# EAGLE schematic USBHubAndSensors (EAGLE 6.0)
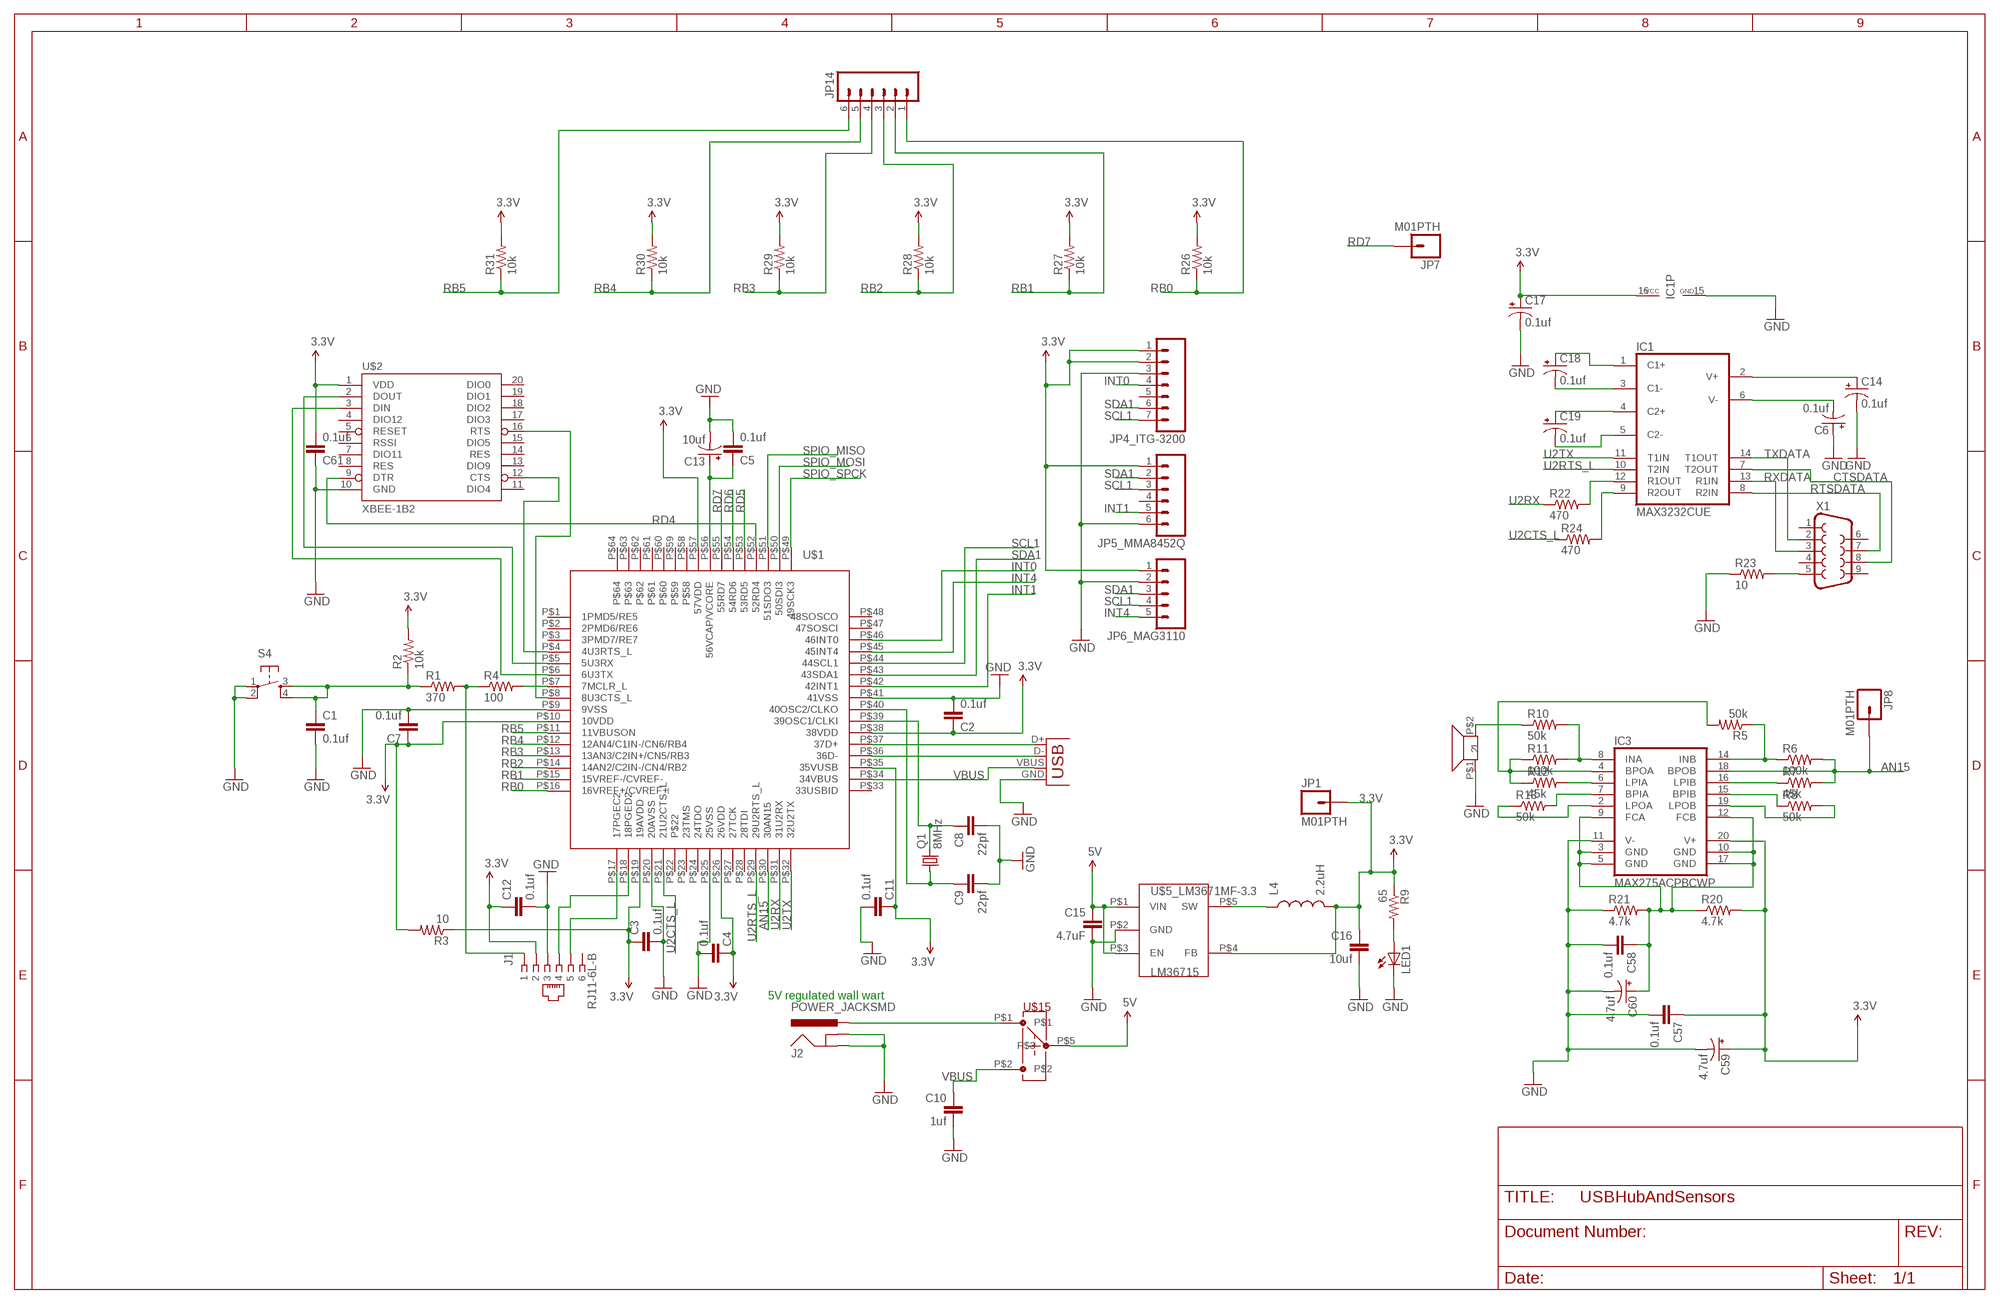
[diagram p0: schematic, sheet 1, part 1 of 2]
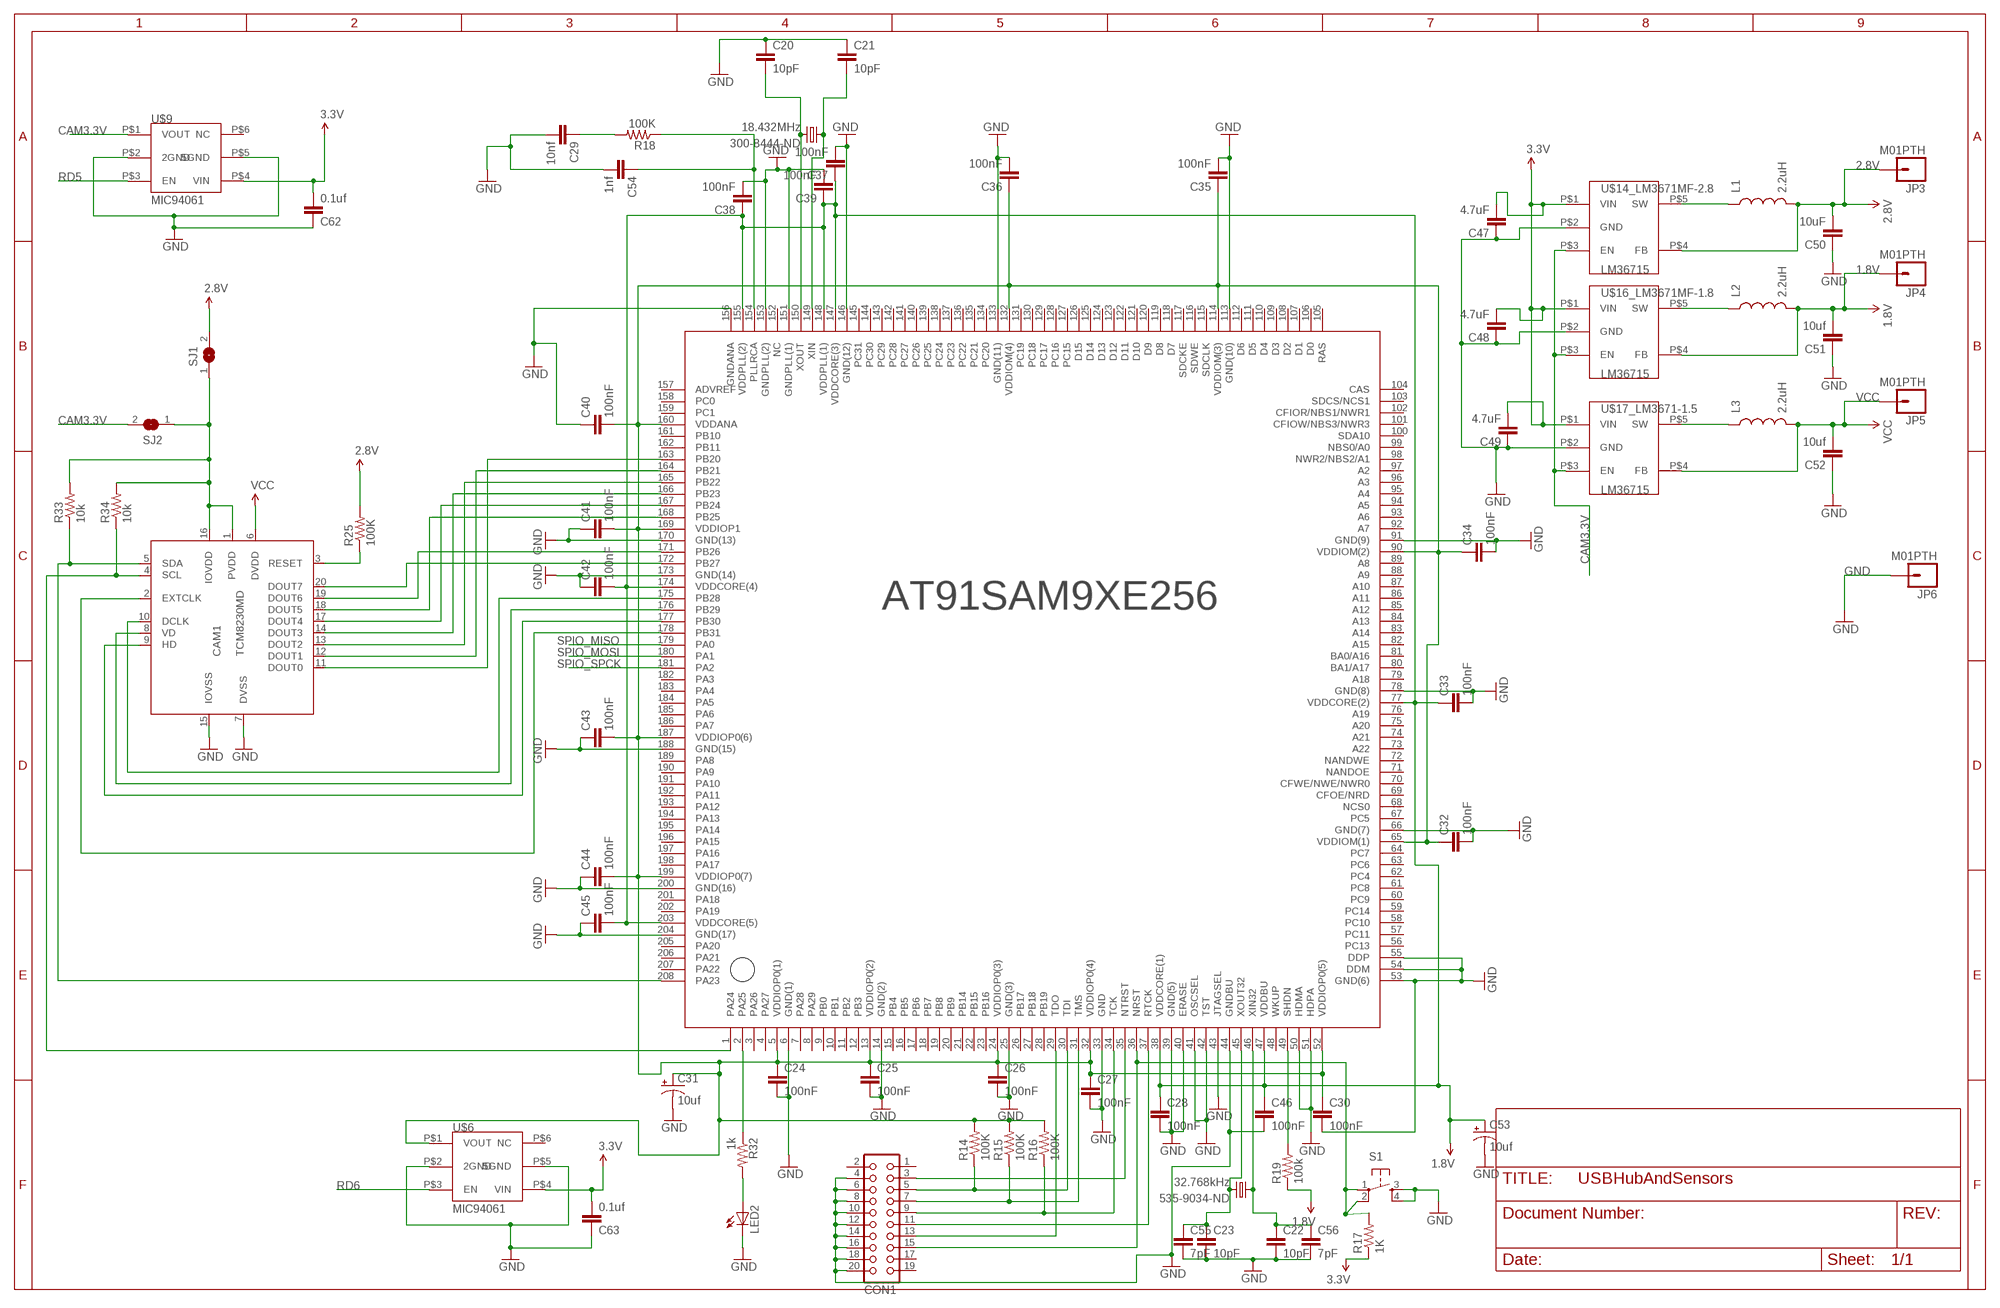
[diagram p1: schematic, sheet 1, part 2 of 2]

## Parts
300-8444-ND  18.432MHz  CRYSTALTC38H  [TC38H]
535-9034-ND  32.768kHz  CRYSTALTC38H  [TC38H]
C1  0.1uf  CAP1206  [1206]
C2  0.1uf  CAP1206  [1206]
C3  0.1uf  CAP1206  [1206]
C4  0.1uf  CAP1206  [1206]
C5  0.1uf  CAP1206  [1206]
C6  0.1uf  CAP_POL1206  [EIA3216]
C7  0.1uf  CAP1206  [1206]
C8  22pf  CAP1206  [1206]
C9  22pf  CAP1206  [1206]
C10  1uf  CAP1206  [1206]
C11  0.1uf  CAP1206  [1206]
C12  0.1uf  CAP1206  [1206]
C13  10uf  CAP_POL1206  [EIA3216]
C14  0.1uf  CAP_POL1206  [EIA3216]
C15  4.7uF  CAP1206  [1206]
C16  10uf  CAP1206  [1206]
C17  0.1uf  CAP_POL1206  [EIA3216]
C18  0.1uf  CAP_POL1206  [EIA3216]
C19  0.1uf  CAP_POL1206  [EIA3216]
C20  10pF  CAP1206  [1206]
C21  10pF  CAP1206  [1206]
C22  10pF  CAP1206  [1206]
C23  10pF  CAP1206  [1206]
C24  100nF  CAP1206  [1206]
C25  100nF  CAP1206  [1206]
C26  100nF  CAP1206  [1206]
C27  100nF  CAP1206  [1206]
C28  100nF  CAP1206  [1206]
C29  10nf  CAP1206  [1206]
C30  100nF  CAP1206  [1206]
C31  10uf  CAP_POL1206  [EIA3216]
C32  100nF  CAP1206  [1206]
C33  100nF  CAP1206  [1206]
C34  100nF  CAP1206  [1206]
C35  100nF  CAP1206  [1206]
C36  100nF  CAP1206  [1206]
C37  100nF  CAP1206  [1206]
C38  100nF  CAP1206  [1206]
C39  100nF  CAP1206  [1206]
C40  100nF  CAP1206  [1206]
C41  100nF  CAP1206  [1206]
C42  100nF  CAP1206  [1206]
C43  100nF  CAP1206  [1206]
C44  100nF  CAP1206  [1206]
C45  100nF  CAP1206  [1206]
C46  100nF  CAP1206  [1206]
C47  4.7uF  CAP1206  [1206]
C48  4.7uF  CAP1206  [1206]
C49  4.7uF  CAP1206  [1206]
C50  10uF  CAP1206  [1206]
C51  10uf  CAP1206  [1206]
C52  10uf  CAP1206  [1206]
C53  10uf  CAP_POL1206  [EIA3216]
C54  1nf  CAP1206  [1206]
C55  7pF  CAP1206  [1206]
C56  7pF  CAP1206  [1206]
C57  0.1uf  CAP1206  [1206]
C58  0.1uf  CAP1206  [1206]
C59  4.7uf  CAP_POL1206  [EIA3216]
C60  4.7uf  CAP_POL1206  [EIA3216]
C61  0.1uf  CAP1206  [1206]
C62  0.1uf  CAP1206  [1206]
C63  0.1uf  CAP1206  [1206]
CAM1  TCM8230MD  [TCM8230MD]
CON1  CON20  [CON20]
IC1  MAX3232CUE  [TSSOP16]
IC3  MAX275ACPBCWP  [SO20L]
J1  RJ11-6L-B  [RJ11-NO_SHIELD]
J2  POWER_JACKSMD  [POWER_JACK_SMD]
JP1  M01PTH  [1X01]
JP3  M01PTH  [1X01]
JP4  M01PTH  [1X01]
JP4_ITG-3200  M07  [1X07]
JP5  M01PTH  [1X01]
JP5_MMA8452Q  M06SIP  [1X06]
JP6  M01PTH  [1X01]
JP6_MAG3110  M05PTH  [1X05]
JP7  M01PTH  [1X01]
JP8  M01PTH  [1X01]
JP14  M06SIP  [1X06]
L1  2.2uH  INDUCTOR1210  [1210]
L2  2.2uH  INDUCTOR1210  [1210]
L3  2.2uH  INDUCTOR1210  [1210]
L4  2.2uH  INDUCTOR1210  [1210]
LED1  LED-FKIT-1206  [FKIT-LED-1206]
LED2  LED-FKIT-1206  [FKIT-LED-1206]
Q1  8MHz  CRYSTALHC49UP  [HC49UP]
R1  370  RESISTOR1206  [1206]
R2  10k  RESISTOR1206  [1206]
R3  10  RESISTOR1206  [1206]
R4  100  RESISTOR1206  [1206]
R5  50k  RESISTOR1206  [1206]
R6  100k  RESISTOR1206  [1206]
R7  45k  RESISTOR1206  [1206]
R8  50k  RESISTOR1206  [1206]
R9  65  RESISTOR1206  [1206]
R10  50k  RESISTOR1206  [1206]
R11  100k  RESISTOR1206  [1206]
R12  45k  RESISTOR1206  [1206]
R13  50k  RESISTOR1206  [1206]
R14  100K  RESISTOR1206  [1206]
R15  100K  RESISTOR1206  [1206]
R16  100K  RESISTOR1206  [1206]
R17  1K  RESISTOR1206  [1206]
R18  100K  RESISTOR1206  [1206]
R19  100k  RESISTOR1206  [1206]
R20  4.7k  RESISTOR1206  [1206]
R21  4.7k  RESISTOR1206  [1206]
R22  470  RESISTOR1206  [1206]
R23  10  RESISTOR1206  [1206]
R24  470  RESISTOR1206  [1206]
R25  100K  RESISTOR1206  [1206]
R26  10k  RESISTOR1206  [1206]
R27  10k  RESISTOR1206  [1206]
R28  10k  RESISTOR1206  [1206]
R29  10k  RESISTOR1206  [1206]
R30  10k  RESISTOR1206  [1206]
R31  10k  RESISTOR1206  [1206]
R32  1k  RESISTOR1206  [1206]
R33  10k  RESISTOR1206  [1206]
R34  10k  RESISTOR1206  [1206]
S1  TAC_SWITCHPTH  [TACTILE-PTH]
S4  TAC_SWITCHPTH  [TACTILE-PTH]
SJ1  SJ  [SJ]
SJ2  SJ  [SJ]
U$1  PIC32MX534F06HTQFP  [64-TQFP]
U$2  XBEE-1B2  [XBEE-SILK]
U$5  40TR-12B  [40TR]
U$5_LM3671MF-3.3  LM36715  [SOT23-5]
U$6  MIC94061YC6  [SC-70-6]
U$7  AT91SAM9XE256  [PQFP208]
U$9  MIC94061YC6  [SC-70-6]
U$14_LM3671MF-2.8  LM36715  [SOT23-5]
U$15  G-107PLUG-IN  [G-197]
U$16_LM3671MF-1.8  LM36715  [SOT23-5]
U$17_LM3671-1.5  LM36715  [SOT23-5]
X1  DB9FEMALE  [DB9]
X2  USB-MICROB  [USB-MICROB]

## Nets
1.8V: C28.1 C33.1 C37.1 C38.1 C39.1 C42.2 C45.2 C46.1 C51.2 C53.A(+) JP4.1 L2.2 R19.1 U$7.38(VDDCORE(1)) U$7.47(VDDBU) U$7.77(VDDCORE(2)) U$7.147(VDDCORE(3)) U$7.148(VDDPLL(1)) U$7.155(VDDPLL(2)) U$7.174(VDDCORE(4)) U$7.203(VDDCORE(5)) U$16_LM3671MF-1.8.P$4(FB)
2.8V: C50.2 JP3.1 L1.2 R25.2 SJ1.2 U$14_LM3671MF-2.8.P$4(FB)
3.3V: C2.1 C3.1 C4.1 C7.1 C11.1 C12.1 C16.1 C17.A(+) C47.2 C48.2 C49.2 C57.1 C59.A(+) C61.2 C62.2 C63.2 IC1.16(VCC) IC3.20(V+) J1.2 JP1.1 JP4_ITG-3200.1 JP4_ITG-3200.2 JP5_MMA8452Q.1 JP6_MAG3110.1 L4.2 R2.2 R3.1 R3.2 R9.1 R17.1 R20.2 R26.2 R27.2 R28.2 R29.2 R30.2 R31.2 U$1.P$10(10VDD) U$1.P$19(19AVDD) U$1.P$26(26VDD) U$1.P$35(35VUSB) U$1.P$38(38VDD) U$1.P$57(57VDD) U$2.1(VDD) U$5_LM3671MF-3.3.P$4(FB) U$6.P$4(VIN) U$9.P$4(VIN) U$14_LM3671MF-2.8.P$1(VIN) U$16_LM3671MF-1.8.P$1(VIN) U$17_LM3671-1.5.P$1(VIN)
5V: C15.1 U$5_LM3671MF-3.3.P$1(VIN) U$5_LM3671MF-3.3.P$3(EN) U$15.P$5
AN15: IC3.18(BPOB) JP8.1 R6.2 R7.2 U$1.P$30(30AN15)
CAM3.3V: SJ2.2 U$9.P$1(VOUT) U$14_LM3671MF-2.8.P$3(EN) U$16_LM3671MF-1.8.P$3(EN) U$17_LM3671-1.5.P$3(EN)
CTSDATA: IC1.7(T2OUT) X1.8
GND: C1.2 C2.2 C3.2 C4.2 C5.2 C6.A(+) C7.2 C8.2 C9.2 C10.2 C11.2 C12.2 C13.C(-) C14.C(-) C15.2 C16.2 C17.C(-) C20.1 C21.1 C22.2 C23.2 C24.2 C25.2 C26.2 C27.2 C28.2 C29.2 C30.2 C31.C(-) C32.2 C33.2 C34.2 C35.2 C36.2 C37.2 C38.2 C39.2 C40.1 C41.1 C42.1 C43.1 C44.1 C45.1 C46.2 C47.1 C48.1 C49.1 C50.1 C51.1 C52.1 C53.C(-) C54.2 C55.2 C56.2 C57.2 C58.2 C59.C(-) C60.C(-) C61.1 C62.1 C63.1 CAM1.7(DVSS) CAM1.15(IOVSS) CON1.4 CON1.6 CON1.8 CON1.10 CON1.12 CON1.14 CON1.16 CON1.18 CON1.20 IC1.15(GND) IC3.11(V-) J1.3 J2.GND(GNDBREAK) J2.P$4(GND) JP4_ITG-3200.3 JP5_MMA8452Q.6 JP6.1 JP6_MAG3110.2 LED1.C LED2.C R21.1 R23.1 S1.3 S1.4 S4.1 S4.2 U$1.P$9(9VSS) U$1.P$20(20AVSS) U$1.P$25(25VSS) U$1.P$41(41VSS) U$2.10(GND) U$5.P$1 U$5_LM3671MF-3.3.P$2(GND) U$6.P$2(2GND) U$6.P$5(5GND) U$7.6(GND(1)) U$7.14(GND(2)) U$7.25(GND(3)) U$7.33(GND) U$7.39(GND(5)) U$7.40(ERASE) U$7.41(OSCSEL) U$7.42(TST) U$7.43(JTAGSEL) U$7.44(GNDBU) U$7.50(HDMA) U$7.51(HDPA) U$7.53(GND(6)) U$7.54(DDM) U$7.55(DDP) U$7.66(GND(7)) U$7.78(GND(8)) U$7.91(GND(9)) U$7.113(GND(10)) U$7.133(GND(11)) U$7.146(GND(12)) U$7.151(GNDPLL(1)) U$7.153(GNDPLL(2)) U$7.156(GNDANA) U$7.170(GND(13)) U$7.173(GND(14)) U$7.188(GND(15)) U$7.200(GND(16)) U$7.204(GND(17)) U$9.P$2(2GND) U$9.P$5(5GND) U$14_LM3671MF-2.8.P$2(GND) U$16_LM3671MF-1.8.P$2(GND) U$17_LM3671-1.5.P$2(GND) X2.GND
INT0: JP4_ITG-3200.4 U$1.P$46(46INT0)
INT1: JP5_MMA8452Q.5 U$1.P$42(42INT1)
INT4: JP6_MAG3110.5 U$1.P$45(45INT4)
N$1: C1.1 R1.1 R2.1 S4.3 S4.4
N$2: C24.1 C25.1 C26.1 C27.1 C30.1 C31.A(+) C32.1 C34.1 C35.1 C36.1 C40.2 C41.2 C43.2 C44.2 R14.2 R15.2 R16.2 U$6.P$1(VOUT) U$7.5(VDDIOP0(1)) U$7.13(VDDIOP0(2)) U$7.24(VDDIOP0(3)) U$7.32(VDDIOP0(4)) U$7.52(VDDIOP0(5)) U$7.65(VDDIOM(1)) U$7.90(VDDIOM(2)) U$7.114(VDDIOM(3)) U$7.132(VDDIOM(4)) U$7.160(VDDANA) U$7.169(VDDIOP1) U$7.187(VDDIOP0(6)) U$7.199(VDDIOP0(7))
N$3: J1.4 U$1.P$18(18PGED2)
N$4: C9.1 Q1.1 U$1.P$40(40OSC2/CLKO)
N$5: C8.1 Q1.2 U$1.P$39(39OSC1/CLKI)
N$6: R4.2 U$1.P$7(7MCLR_L)
N$7: J1.5 U$1.P$17(17PGEC2)
N$8: L4.1 U$5_LM3671MF-3.3.P$5(SW)
N$9: U$1.P$6(6U3TX) U$2.3(DIN)
N$10: C18.A(+) IC1.1(C1+)
N$11: C18.C(-) IC1.3(C1-)
N$12: C19.A(+) IC1.4(C2+)
N$13: C5.1 C13.A(+) U$1.P$56(56VCAP/VCORE)
N$14: U$1.P$36(36D-) X2.D-
N$15: U$1.P$37(37D+) X2.D+
N$16: C19.C(-) IC1.5(C2-)
N$17: U$1.P$5(5U3RX) U$2.2(DOUT)
N$18: U$1.P$8(8U3CTS_L) U$2.16(RTS)
N$19: U$1.P$4(4U3RTS_L) U$2.12(CTS)
N$20: CON1.11 U$7.37(RTCK)
N$21: J1.1 R1.2 R4.1
N$22: CAM1.3(RESET) R25.1
N$23: C14.A(+) IC1.2(V+)
N$24: C6.C(-) IC1.6(V-)
N$25: IC3.14(INB) R5.1 R6.1
N$26: R10.1 U$5.P$2
N$27: IC3.16(LPIB) R7.1
N$28: LED1.A R9.2
N$29: IC3.15(BPIB) R8.1
N$30: IC3.19(LPOB) R8.2
N$31: IC3.2(LPOA) R13.1
N$32: IC3.7(BPIA) R13.2
N$33: IC3.6(LPIA) R12.2
N$34: IC3.8(INA) R10.2 R11.2
N$35: IC3.4(BPOA) R5.2 R11.1 R12.1
N$36: CAM1.11(DOUT0) U$7.163(PB20)
N$37: CAM1.12(DOUT1) U$7.164(PB21)
N$38: CAM1.13(DOUT2) U$7.165(PB22)
N$39: CAM1.14(DOUT3) U$7.166(PB23)
N$40: CAM1.17(DOUT4) U$7.167(PB24)
N$41: CAM1.18(DOUT5) U$7.168(PB25)
N$42: CAM1.19(DOUT6) U$7.171(PB26)
N$43: CAM1.20(DOUT7) U$7.172(PB27)
N$44: CAM1.10(DCLK) U$7.175(PB28)
N$45: CAM1.8(VD) U$7.176(PB29)
N$46: CAM1.9(HD) U$7.177(PB30)
N$47: CAM1.2(EXTCLK) U$7.178(PB31)
N$48: CAM1.4(SCL) R34.1 U$7.1(PA24)
N$49: CAM1.5(SDA) R33.1 U$7.208(PA23)
N$50: 300-8444-ND.1 C21.2 U$7.149(XIN)
N$51: 300-8444-ND.2 C20.2 U$7.150(XOUT)
N$52: 535-9034-ND.1 C22.1 C56.1 U$7.46(XIN32)
N$53: 535-9034-ND.2 C23.1 C55.1 U$7.45(XOUT32)
N$54: CON1.5 R14.1 U$7.30(TDI)
N$55: CON1.7 R15.1 U$7.31(TMS)
N$56: CON1.9 R16.1 U$7.34(TCK)
N$57: CON1.13 U$7.29(TDO)
N$58: CON1.3 U$7.35(NTRST)
N$59: CAM1.1(PVDD) CAM1.16(IOVDD) R33.2 R34.2 SJ1.1 SJ2.1
N$60: L1.1 U$14_LM3671MF-2.8.P$5(SW)
N$61: L2.1 U$16_LM3671MF-1.8.P$5(SW)
N$62: L3.1 U$17_LM3671-1.5.P$5(SW)
N$63: C54.1 R18.1 U$7.154(PLLRCA)
N$64: C29.1 R18.2
N$65: R19.2 U$7.49(SHDN)
N$66: J2.VIN0(PWR) U$15.P$1
N$67: IC1.12(R1OUT) R22.2
N$68: C58.1 C60.A(+) IC3.3(GND) IC3.5(GND) IC3.9(FCA) IC3.10(GND) IC3.12(FCB) IC3.17(GND) R20.1 R21.2
N$69: R23.2 X1.5
N$70: R32.1 U$7.2(PA25)
N$71: IC1.9(R2OUT) R24.2
N$72: LED2.A R32.2
N$80: CON1.15 R17.2 S1.1 S1.2 U$7.36(NRST)
RB0: JP14.1 R26.1 U$1.P$16(16VREF+/CVREF+)
RB1: JP14.2 R27.1 U$1.P$15(15VREF-/CVREF-)
RB2: JP14.3 R28.1 U$1.P$14(14AN2/C2IN-/CN4/RB2)
RB3: JP14.4 R29.1 U$1.P$13(13AN3/C2IN+/CN5/RB3)
RB4: JP14.5 R30.1 U$1.P$12(12AN4/C1IN-/CN6/RB4)
RB5: JP14.6 R31.1 U$1.P$11(11VBUSON)
RD4: U$1.P$52(52RD4) U$2.9(DTR)
RD5: U$1.P$53(53RD5) U$9.P$3(EN)
RD6: U$1.P$54(54RD6) U$6.P$3(EN)
RD7: JP7.1 U$1.P$55(55RD7)
RTSDATA: IC1.8(R2IN) X1.7
RXDATA: IC1.13(R1IN) X1.3
SCL1: JP4_ITG-3200.7 JP5_MMA8452Q.3 JP6_MAG3110.4 U$1.P$44(44SCL1)
SDA1: JP4_ITG-3200.6 JP5_MMA8452Q.2 JP6_MAG3110.3 U$1.P$43(43SDA1)
SPIO_MISO: U$1.P$51(51SDO3) U$7.179(PA0)
SPIO_MOSI: U$1.P$50(50SDI3) U$7.180(PA1)
SPIO_SPCK: U$1.P$49(49SCK3) U$7.181(PA2)
TXDATA: IC1.14(T1OUT) X1.2
U2CTS_L: R24.1 U$1.P$21(21U2CTS_L)
U2RTS_L: IC1.10(T2IN) U$1.P$29(29U2RTS_L)
U2RX: R22.1 U$1.P$31(31U2RX)
U2TX: IC1.11(T1IN) U$1.P$32(32U2TX)
VBUS: C10.1 U$1.P$34(34VBUS) U$15.P$2 X2.VBUS
VCC: C52.2 CAM1.6(DVDD) JP5.1 L3.2 U$17_LM3671-1.5.P$4(FB)
Unconnected: CON1.1 CON1.2 CON1.17 CON1.19 J1.6 JP4_ITG-3200.5 JP5_MMA8452Q.4 U$1.P$1(1PMD5/RE5) U$1.P$2(2PMD6/RE6) U$1.P$3(3PMD7/RE7) U$1.P$22 U$1.P$23(23TMS) U$1.P$24(24TDO) U$1.P$27(27TCK) U$1.P$28(28TDI) U$1.P$33(33USBID) U$1.P$47(47SOSCI) U$1.P$48(48SOSCO) U$1.P$58 U$1.P$59 U$1.P$60 U$1.P$61 U$1.P$62 U$1.P$63 U$1.P$64 U$2.4(DIO12) U$2.5(RESET) U$2.6(RSSI) U$2.7(DIO11) U$2.8(RES) U$2.11(DIO4) U$2.13(DIO9) U$2.14(RES) U$2.15(DIO5) U$2.17(DIO3) U$2.18(DIO2) U$2.19(DIO1) U$2.20(DIO0) U$6.P$6(NC) U$7.3(PA26) U$7.4(PA27) U$7.7(PA28) U$7.8(PA29) U$7.9(PB0) U$7.10(PB1) U$7.11(PB2) U$7.12(PB3) U$7.15(PB4) U$7.16(PB5) U$7.17(PB6) U$7.18(PB7) U$7.19(PB8) U$7.20(PB9) U$7.21(PB14) U$7.22(PB15) U$7.23(PB16) U$7.26(PB17) U$7.27(PB18) U$7.28(PB19) U$7.48(WKUP) U$7.56(PC13) U$7.57(PC11) U$7.58(PC10) U$7.59(PC14) U$7.60(PC9) U$7.61(PC8) U$7.62(PC4) U$7.63(PC6) U$7.64(PC7) U$7.67(PC5) U$7.68(NCS0) U$7.69(CFOE/NRD) U$7.70(CFWE/NWE/NWR0) U$7.71(NANDOE) U$7.72(NANDWE) U$7.73(A22) U$7.74(A21) U$7.75(A20) U$7.76(A19) U$7.79(A18) U$7.80(BA1/A17) U$7.81(BA0/A16) U$7.82(A15) U$7.83(A14) U$7.84(A13) U$7.85(A12) U$7.86(A11) U$7.87(A10) U$7.88(A9) U$7.89(A8) U$7.92(A7) U$7.93(A6) U$7.94(A5) U$7.95(A4) U$7.96(A3) U$7.97(A2) U$7.98(NWR2/NBS2/A1) U$7.99(NBS0/A0) U$7.100(SDA10) U$7.101(CFIOW/NBS3/NWR3) U$7.102(CFIOR/NBS1/NWR1) U$7.103(SDCS/NCS1) U$7.104(CAS) U$7.105(RAS) U$7.106(D0) U$7.107(D1) U$7.108(D2) U$7.109(D3) U$7.110(D4) U$7.111(D5) U$7.112(D6) U$7.115(SDCLK) U$7.116(SDWE) U$7.117(SDCKE) U$7.118(D7) U$7.119(D8) U$7.120(D9) U$7.121(D10) U$7.122(D11) U$7.123(D12) U$7.124(D13) U$7.125(D14) U$7.126(D15) U$7.127(PC15) U$7.128(PC16) U$7.129(PC17) U$7.130(PC18) U$7.131(PC19) U$7.134(PC20) U$7.135(PC21) U$7.136(PC22) U$7.137(PC23) U$7.138(PC24) U$7.139(PC25) U$7.140(PC26) U$7.141(PC27) U$7.142(PC28) U$7.143(PC29) U$7.144(PC30) U$7.145(PC31) U$7.152(NC) U$7.157(ADVREF) U$7.158(PC0) U$7.159(PC1) U$7.161(PB10) U$7.162(PB11) U$7.182(PA3) U$7.183(PA4) U$7.184(PA5) U$7.185(PA6) U$7.186(PA7) U$7.189(PA8) U$7.190(PA9) U$7.191(PA10) U$7.192(PA11) U$7.193(PA12) U$7.194(PA13) U$7.195(PA14) U$7.196(PA15) U$7.197(PA16) U$7.198(PA17) U$7.201(PA18) U$7.202(PA19) U$7.205(PA20) U$7.206(PA21) U$7.207(PA22) U$9.P$6(NC) X1.1 X1.4 X1.6 X1.9

## Notes on the sheet
- 5V regulated wall wart

## Library data of the parts
300-8444-ND 535-9034-ND = SparkFun-FreqCtrl:CRYSTAL: Various standard crystals. Proven footprints. Spark Fun Electronics SKU : COM-00534
C1-C5 C7-C12 C15 C16 C20-C30 C32-C52 C54-C58 C61-C63 = SparkFun-Passives:CAP: Capacitor Standard 0603 ceramic capacitor, and 0.1" leaded capacitor.
C6 C13 C14 C17-C19 C31 C53 C59 C60 = SparkFun-Passives:CAP_POL: Capacitor Polarized These are standard SMD and PTH capacitors. Normally 10uF, 47uF, and 100uF in electrolytic and tantalum varieties. Always verify the external diameter of the through hole cap, it varies with capacity, voltage, and manufacturer. The EIA devices should be standard.
CAM1 = AT91SAM9XE256:TCM8230MD: TCM8240MD 0.3 Mega pixel sensor chip mfg TOSHIBA symbol/package by Kyrre Aalerud Note: Chip has pads for socket mounting on underside. Do not route anything under the chip unless you insulate it.
CON1 = con-harting:CON20: CONNECTOR; OC_FARNELL: unknown; OC_NEWARK: unknown
IC1 = maxim:MAX3232*: True RS-232 Transceivers 3.0V to 5.5V, Low-Power up to 1Mbps, Using Four 0.1µF External Capacitors Source: http://pdfserv.maxim-ic.com/en/ds/MAX3222-MAX3241.pdf; MF: MAXIM; MPN: MAX3232CUE+; OC_FARNELL: 1593350; OC_NEWARK: 68K4629
IC3 = maxim:MAX275ACP: ANALOG FILTER
J1 = con-tycoelectronics:RJ11: CORCOM Modular RJ Jacks No Shield Source: www.tycoelectronics.com .. ENG_DS_1654001_1099_RJ_L_0507.pdf; MF: TYCO ELECTRONICS; MPN: RJ11-6L-B; OC_FARNELL: unknown; OC_NEWARK: 52K3613
J2 = SparkFun-Connectors:POWER_JACK: Power Jack This is the standard 5.5mm barrel jack for power. The PTH is the most common, proven, reliable, footprint. All others are experimental. The Slot footprint only works if the mill layer is transmitted to the PCB fab house so be warned. Spark Fun Electronics SKU : PRT-00119. Mating wall wart : TOL-00298 (and others)
JP1 JP3-JP8 = SparkFun-Connectors:M01: Header 1 Standard 1-pin 0.1" header. Use with straight break away headers (SKU : PRT-00116), right angle break away headers (PRT-00553), swiss pins (PRT-00743), machine pins (PRT-00117), and female headers (PRT-00115).
JP4_ITG-3200 = SparkFun-Connectors:M07: Header 7 Standard 7-pin 0.1" header. Use with straight break away headers (SKU : PRT-00116), right angle break away headers (PRT-00553), swiss pins (PRT-00743), machine pins (PRT-00117), and female headers (PRT-00115). NOTES ON THE VARIANTS LOCK and LOCK_LONGPADS... This footprint was designed to help hold the alignment of a through-hole component (i.e. 7-pin header) while soldering it into place. You may notice that each hole has been shifted either up or down by 0.005 of an inch from it's more standard position (which is usually a perfectly straight line). This slight alteration caused the pins (the squares in the middle) to touch the edges of the holes. Because they are alternating, it causes a "brace" to hold the header in place. 0.005 has proven to be the perfect amount of "off-center" position when using our standard breakaway headers. Although looks a little odd when you look at the bare footprint, once you have a header in there, the alteration is very hard to notice. Also, if you push a header all the way into place, it is covered up entirely on the bottom side. This idea of altering the position of holes to aid alignment will be further integrated into the Sparkfun Library for other footprints. It can help hold any component with 3 or more connection pins.
JP5_MMA8452Q JP14 = SparkFun-Connectors:M06: Header 6 Standard 6-pin 0.1" header. Use with straight break away headers (SKU : PRT-00116), right angle break away headers (PRT-00553), swiss pins (PRT-00743), machine pins (PRT-00117), and female headers (PRT-00115). Molex polarized connector foot print use with SKU : PRT-08094 with associated crimp pins and housings. NOTES ON THE VARIANTS LOCK and LOCK_LONGPADS... This footprint was designed to help hold the alignment of a through-hole component (i.e. 6-pin header) while soldering it into place. You may notice that each hole has been shifted either up or down by 0.005 of an inch from it's more standard position (which is a perfectly straight line). This slight alteration caused the pins (the squares in the middle) to touch the edges of the holes. Because they are alternating, it causes a "brace" to hold the component in place. 0.005 has proven to be the perfect amount of "off-center" position when using our standard breakaway headers. Although looks a little odd when you look at the bare footprint, once you have a header in there, the alteration is very hard to notice. Also, if you push a header all the way into place, it is covered up entirely on the bottom side. This idea of altering the position of holes to aid alignment will be further integrated into the Sparkfun Library for other footprints. It can help hold any component with 3 or more connection pins.
JP6_MAG3110 = SparkFun-Connectors:M05: Header 5 Standard 5-pin 0.1" header. Use with straight break away headers (SKU : PRT-00116), right angle break away headers (PRT-00553), swiss pins (PRT-00743), machine pins (PRT-00117), and female headers (PRT-00115). Molex polarized connector foot print use with SKU : PRT-08230 with associated crimp pins and housings.
L1-L4 = SparkFun-Passives:INDUCTOR: Inductors Basic Inductor/Choke - 0603 and 1206. Footprints are not proven and vary greatly between part numbers.
LED1 LED2 = SparkFun-LED:LED: LEDs Standard schematic elements and footprints for 5mm, 3mm, 1206, and 0603 sized LEDs. 5mm - Spark Fun Electronics SKU : COM-00529 (and others)
Q1 = crystal:CRYSTAL: CRYSTAL; OC_FARNELL: unknown; OC_NEWARK: unknown
R1-R34 = SparkFun-Passives:RESISTOR: Resistor Basic schematic elements and footprints for 0603, 1206, and PTH resistors.
S1 S4 = SparkFun-Electromechanical:TAC_SWITCH: Momentary Switch Button commonly used for reset or general input. Spark Fun Electronics SKU : COM-00097
SJ1 SJ2 = jumper:SJ: SMD solder JUMPER
U$1 = hw1:PIC32MX534F06H
U$2 = SparkFun-RF:XBEE-1: Xbee module footprints
U$5 = hw1:40TR-12
U$5_LM3671MF-3.3 U$14_LM3671MF-2.8 U$16_LM3671MF-1.8 U$17_LM3671-1.5 = hw1:LM3671
U$6 U$9 = hw1:MIC94061
U$7 = AT91SAM9XE256:AT91SAM9XE256
U$15 = hw1:G-107
X1 = SparkFun-Connectors:DB9: DB9 Connector Standard DB9 (D-Sub 9) serial connector. Can be used for CAN bus as well as RS485 and RS232. Footprint production proven. Spark Fun Electronics SKU : PRT-00429
X2 = SparkFun-Connectors:USB: USB Connectors USB-B-PTH is fully proven SKU : PRT-00139 USB-miniB is fully proven SKU : PRT-00587 USB-A-PCB is untested. USB-A-H is throughly reviewed, but untested. Spark Fun Electronics SKU : PRT-00437 USB-B-SMT is throughly reviewed, but untested. Needs silkscreen touching up. USB-A-S has not been used/tested USB-MB-H has not been used/tested